# Altium schematic sheet Temp_converter.SchDoc
size A
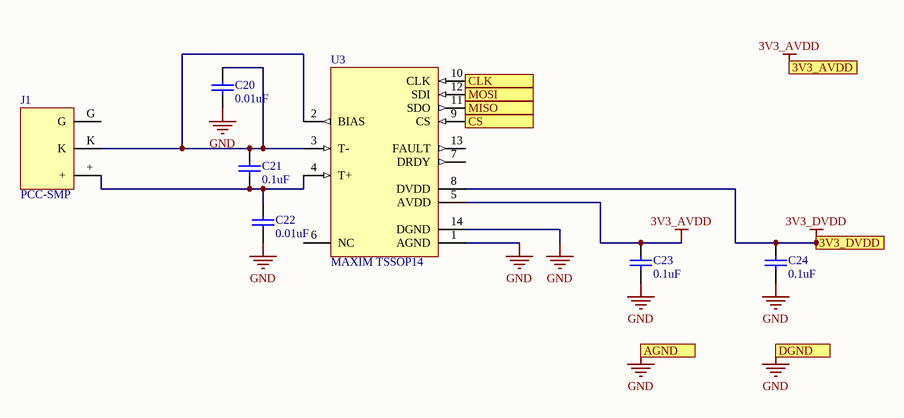
[diagram p0: Temp_converter.SchDoc]

## Parts
C20  0.01uF  [C0805]
C21  0.1uF  [C0805]
C22  0.01uF  [C0805]
C23  0.1uF  [C0805]
C24  0.1uF  [C0805]
J1  PCC-SMP  [PCC-SMP]
U3  MAXIM TSSOP14  [MAXIM TSSOP14]

## Ports
3V3_AVDD, 3V3_DVDD, AGND, CLK, CS, DGND, MISO, MOSI

## Nets
3V3_AVDD: C23.1 U3.5(AVDD) ; port 3V3_AVDD
3V3_DVDD: C24.1 U3.8(DVDD) ; port 3V3_DVDD
GND: C20.2 C22.2 C23.2 C24.2 U3.1(AGND) U3.14(DGND) ; port AGND, port DGND
CLK: U3.10(CLK) ; port CLK
CS: U3.9(CS) ; port CS
MISO: U3.11(SDO) ; port MISO
MOSI: U3.12(SDI) ; port MOSI
NetC20_1: C20.1 C21.1 J1.K U3.2(BIAS) U3.3(T-)
NetC21_2: C21.2 C22.1 J1.+ U3.4(T+)

Not connected (* = marked no-connect by the designer): J1 G; U3 6(NC) 7(DRDY) 13(FAULT)

## Library data of the parts
C20-C24 = C0805: 0805 Capacitor
  C20 C22: Value: 0.01uF
  C21 C23 C24: Value: 0.1uF
J1 = PCC-SMP: THERMOCOUPLE CONNECTOR